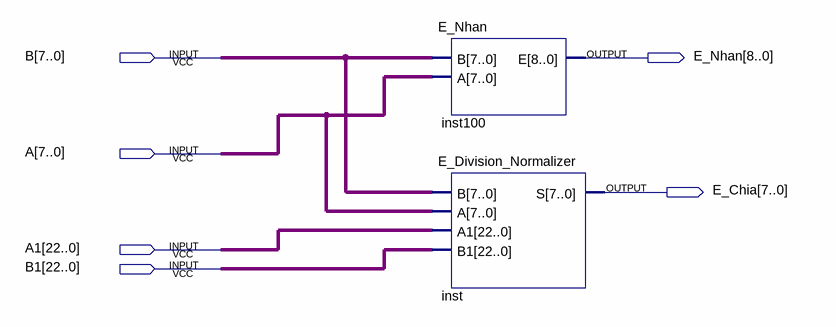
[diagram p0: schematic sheet]
// Quartus schematic E.bdf as structural Verilog: 2 symbols, 6 pins
module E (
  input  [7:0] B,
  input  [7:0] A,
  input  [22:0] A1,
  input  [22:0] B1,
  output [8:0] E_Nhan,
  output [7:0] E_Chia
);

  E_Nhan inst100 (.B(B), .A(A), .E(E_Nhan));
  E_Division_Normalizer inst (.B(B), .A(A), .A1(A1), .B1(B1), .S(E_Chia));
endmodule
